# EAGLE design NEO-M8N+BMP280 Wing (EAGLE 9.0.1)
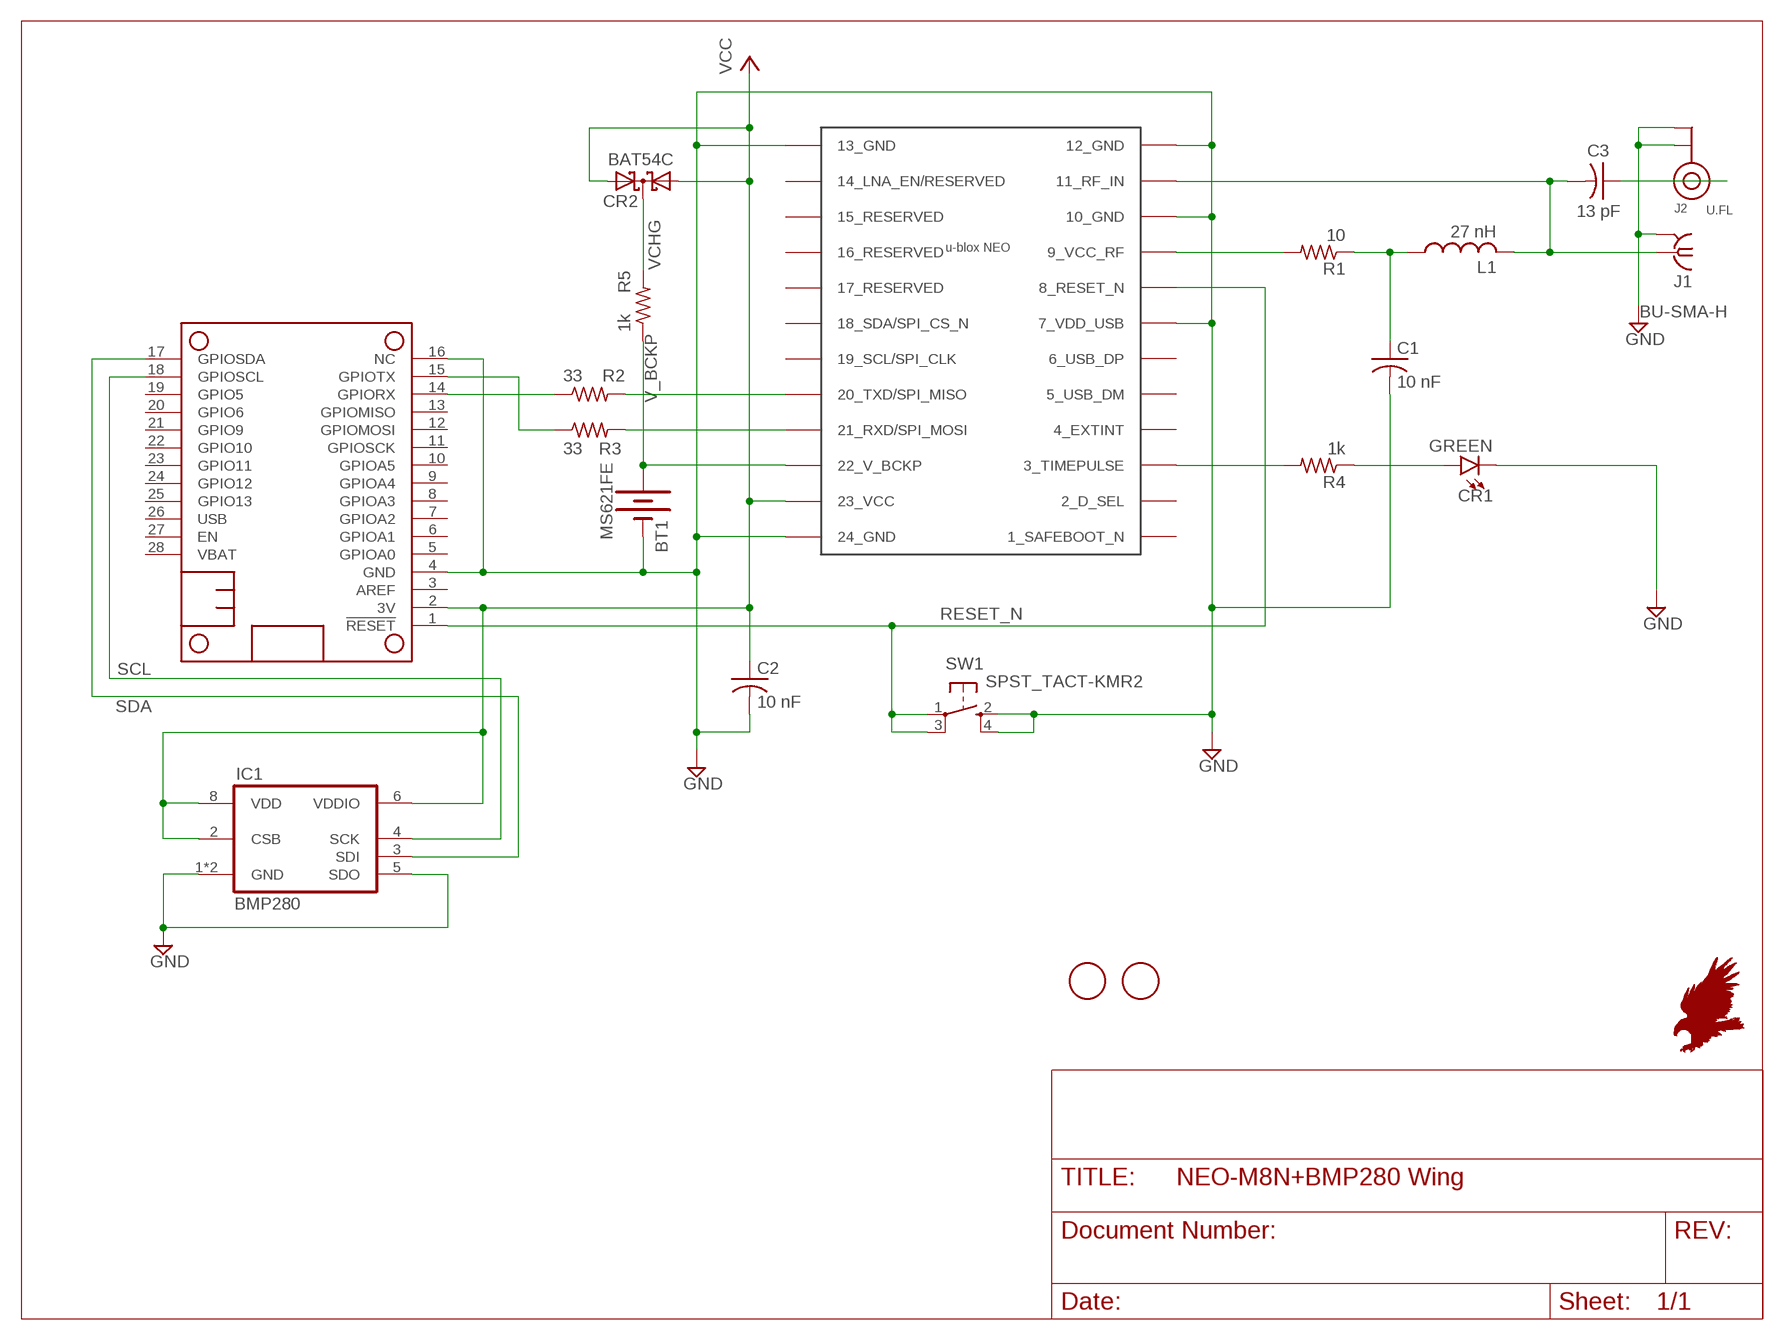
[diagram p0: schematic, sheet 1]

## Parts
BT1  MS621FE  BATTERY-6.8MM_SMD  [BATTCON-6.8MM]
C1  10 nF  C-USC0402  [C0402]
C2  10 nF  C-USC0402  [C0402]
C3  13 pF  C-USC0402  [C0402]
CR1  GREEN  LED-GREEN0603  [LED-0603]
CR2  BAT54C  [SOT23]
FID1  FIDUCIAL  [FIDUCIAL_1MM]
FID2  FIDUCIAL  [FIDUCIAL_1MM]
IC1  BMP280  [BMP280]
J1  BU-SMA-H  [BU-SMA-H]
J2  U.FL  ANTENNA_U.FL  [U.FL]
L1  27 nH  L-US0402  [L0402]
MS1  FEATHERWING  [FEATHERWING]
R1  10  R-US_R0805  [R0805]
R2  33  R-US_R0805  [R0805]
R3  33  R-US_R0805  [R0805]
R4  1k  R-US_R0805  [R0805]
R5  1k  R-US_R0805  [R0805]
SW1  SPST_TACT-KMR2  [KMR2]
U$2  NEO-M8  [NEO-M8]

## Nets
FEATHER_RXD: MS1.14(GPIORX) R2.1
FEATHER_TXD: MS1.15(GPIOTX) R3.1
GND [GND]: BT1.- C1.2 C2.2 CR1.C IC1.1(GND) IC1.5(SDO) IC1.7(GND) J1.2 J1.3 J1.4 J1.5 J2.1(GND) J2.2(GND) MS1.4(GND) MS1.16(NC) SW1.2(S) SW1.4(S1) U$2.7(7_VDD_USB) U$2.10(10_GND) U$2.12(12_GND) U$2.13(13_GND) U$2.24(24_GND)
GPS_RXD: R3.2 U$2.21(21_RXD/SPI_MOSI)
GPS_TXD: R2.2 U$2.20(20_TXD/SPI_MISO)
J2_RF: C3.1 J2.3(SIGNAL)
LED_ANODE: CR1.A R4.1
LNA_BIAS [VCC]: C1.1 L1.P$1 R1.1
RESET_N: MS1.1(!RESET) SW1.1(P) SW1.3(P1) U$2.8(8_RESET_N)
RF_IN [RF_IN]: C3.2 J1.1 L1.P$2 U$2.11(11_RF_IN)
SCL: IC1.4(SCK) MS1.18(GPIOSCL)
SDA: IC1.3(SDI) MS1.17(GPIOSDA)
TP: R4.2 U$2.3(3_TIMEPULSE)
V_BCKP: BT1.+ R5.1 U$2.22(22_V_BCKP)
VCC [VCC]: C2.1 CR2.1(A1) CR2.2(A2) IC1.2(CSB) IC1.6(VDDIO) IC1.8(VDD) MS1.2(3V) U$2.23(23_VCC)
VCC_RF [VCC]: R1.2 U$2.9(9_VCC_RF)
VCHG: CR2.3(CC) R5.2
Unconnected: MS1.3(AREF) MS1.5(GPIOA0) MS1.6(GPIOA1) MS1.7(GPIOA2) MS1.8(GPIOA3) MS1.9(GPIOA4) MS1.10(GPIOA5) MS1.11(GPIOSCK) MS1.12(GPIOMOSI) MS1.13(GPIOMISO) MS1.19(GPIO5) MS1.20(GPIO6) MS1.21(GPIO9) MS1.22(GPIO10) MS1.23(GPIO11) MS1.24(GPIO12) MS1.25(GPIO13) MS1.26(USB) MS1.27(EN) MS1.28(VBAT) U$2.1(1_SAFEBOOT_N) U$2.2(2_D_SEL) U$2.4(4_EXTINT) U$2.5(5_USB_DM) U$2.6(6_USB_DP) U$2.14(14_LNA_EN/RESERVED) U$2.15(15_RESERVED) U$2.16(16_RESERVED) U$2.17(17_RESERVED) U$2.18(18_SDA/SPI_CS_N) U$2.19(19_SCL/SPI_CLK)

## Library data of the parts
BT1 = SparkFun-Batteries:BATTERY: Battery - Single Cell A variety of battery chemistries, sizes, and footprints. Device List: 20MM_PTH - Coin Cell Battery Holder - 20mm (PTH) <https://www.sparkfun.com/products/783> 6.8MM_PTH - Coin Cell Battery Holder - 6.8MM(SMD) <https://www.digikey.com/product-detail/en/seiko-instruments/MS621FE-FL11E/728-1057-ND/1889208?WT.srch=1&gclid=CNOQ5a6LzdQCFZS2wAodXCkE0g> 12MM_SMD - Coin Cell Battery Holder - 12mm (SMD) <https://www.sparkfun.com/products/10592> 12MM_PTH - Coin Cell Battery Holder - 12mm (PTH) <https://www.sparkfun.com/products/7948> 20MM_SMD - 20mm Coin Cell Battery Holder (SMD) (2 legs) Used on the Big Time Watch Kit <https://www.sparkfun.com/products/11734> 20MM_SMD_4LEGS - Coin Cell Battery Holder - 20mm (SMD) <https://www.sparkfun.com/products/11892> 20MM_SMD_4LEGS_OVERPASTE - Coin Cell Battery Holder - 20mm (SMD) <https://www.sparkfun.com/products/11892> (Over-paste on the legs) 24.5MM_PTH - Coin Cell Battery Holder - 24.5mm (PTH) <https://www.sparkfun.com/products/8863> 9V - 9V Battery Holder - PC Mount Used on the SparkFun SparkPunk Sound Kit <https://www.sparkfun.com/products/11177> and SparkFun SparkPunk Sequencer Kit <https://www.sparkfun.com/products/12707> 18650 - Battery Holder - 18650 (PTH) <https://www.sparkfun.com/products/13113> AA - Battery Holder - 1xAA (PTH) <https://www.sparkfun.com/products/7949> AAA - Battery Holder - 1xAAA (PTH) <https://www.sparkfun.com/products/12718> AA_KIT - Battery Holder - 1xAA (PTH) <https://www.sparkfun.com/products/7949> Special kit package - pads only have exposed copper on one side of the board. AAA_KIT - Battery Holder - 1xAAA (PTH) <https://www.sparkfun.com/products/12718> Special kit package - pads only have exposed copper on one side of the board.; PROD_ID: BATT-13734; VALUE: 6.8MM_COIN_CELL
C1-C3 = adafruit:C-US: CAPACITOR, American symbol
CR1 = SparkFun-LED:LED-GREEN: Green SMD LED Used in manufacturing of various products at SparkFun Packages: 0603 - SMD 0603 package [Product Link] <http://www.futureelectronics.com/en/technologies/semiconductors/optoelectronics/leds/Pages/9894312-LTST-C190GKT.aspx?CrossPart=HSMG-C190&IM=0> LilyPad 1206 - SMD1206 LilyPad package [Product Link] <http://www.futureelectronics.com/en/Technologies/Product.aspx?ProductID=IN150NGHARVATEKCORPORATION2049943&IM=0> 1206 - SMD1206 package [Product Link] <http://www.futureelectronics.com/en/technologies/semiconductors/optoelectronics/leds/Pages/8315665-LTST-C150KGKT.aspx?IM=0> 1206 Bottom Mount -SMD 1206 Bottom Mount [Product Link] <http://www.digikey.com/product-detail/en/lite-on-inc/LTST-C230KGKT/160-1456-1-ND/386854> SparkFun Products: Pro Mini 328 -5V <https://www.sparkfun.com/products/821> RedBoard <https://www.sparkfun.com/products/12757> MP3 Trigger <https://www.sparkfun.com/products/13720> Makey Makey <https://www.sparkfun.com/products/11076>; PROD_ID: DIO-00821
CR2 = diode:BAT54C: Schottky Diodes Source: Fairchild .. BAT54.pdf
FID1 FID2 = adafruit:FIDUCIAL: For use by pick and place machines to calibrate the vision/machine, 1mm By microbuilder.eu
IC1 = bosch-bmp280:BMP280: The BMP280 is an absolute barometric pressure sensor especially designed for mobile applications. The sensor module is housed in an extremely compact 8-pin metal-lid LGA package with a footprint of only 2.0 × 2.5 mm2 and 0.95 mm package height. Its small dimensions and its low power consumption of 2.7 μA @1Hz allow the implementation in battery driven devices such as mobile phones, GPS modules or watches. The library has been designed by Richard Magdycz <https://www.facebook.com/groups/eaglecadsoftUK>
J1 = con-coax:BU-SMA-H: FEMALE SMA CONNECTOR Radiall; OC_FARNELL: unknown; OC_NEWARK: unknown
J2 = adafruit:ANTENNA_U.FL: U.FL Antenna Connector
L1 = murata-inductors:L-US
MS1 = adafruit:FEATHERWING
R1-R5 = adafruit:R-US_: RESISTOR, American symbol
SW1 = adafruit:SPST_TACT: SMT 6mm switch, EVQQ2 series http://www.ladyada.net/library/eagle
U$2 = ubloxLib:NEO-M8: u-blox NEO GNSS module

## Net classes
0 default: width 0.254 mm
1 GND: width 0.635 mm
2 VCC: width 0.381 mm
3 RF_IN: width 0.508 mm

## Board
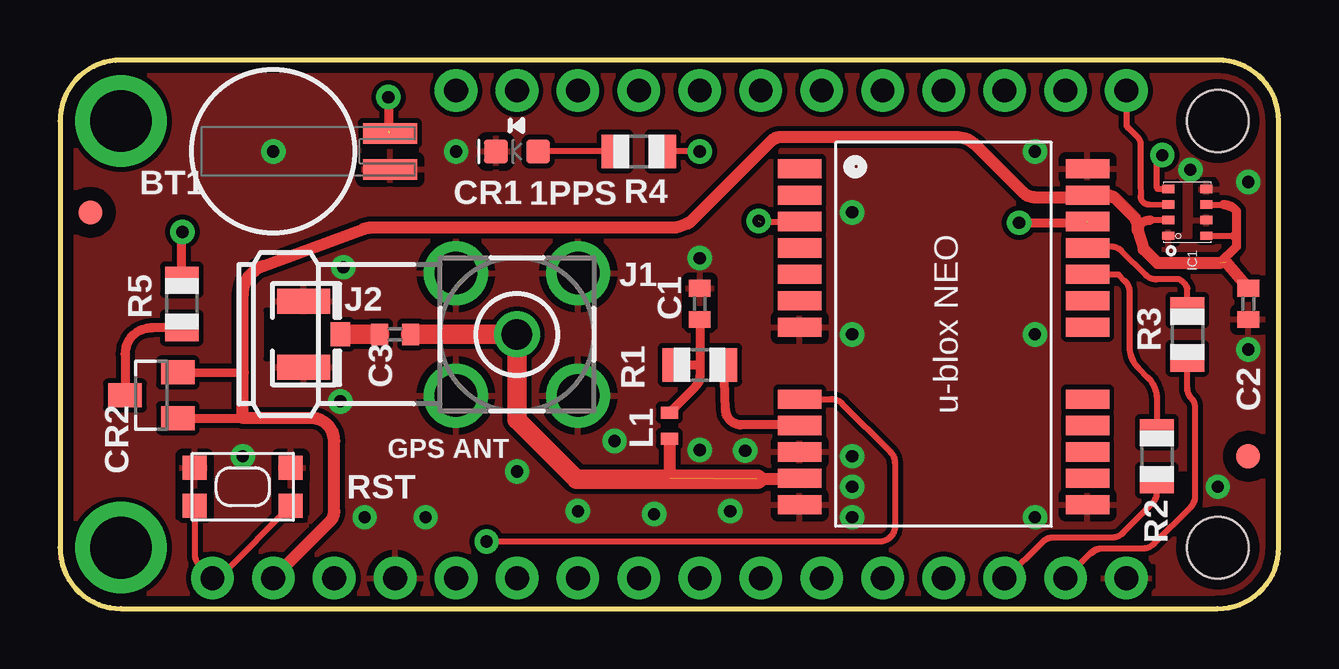
[diagram p1: board, top side]
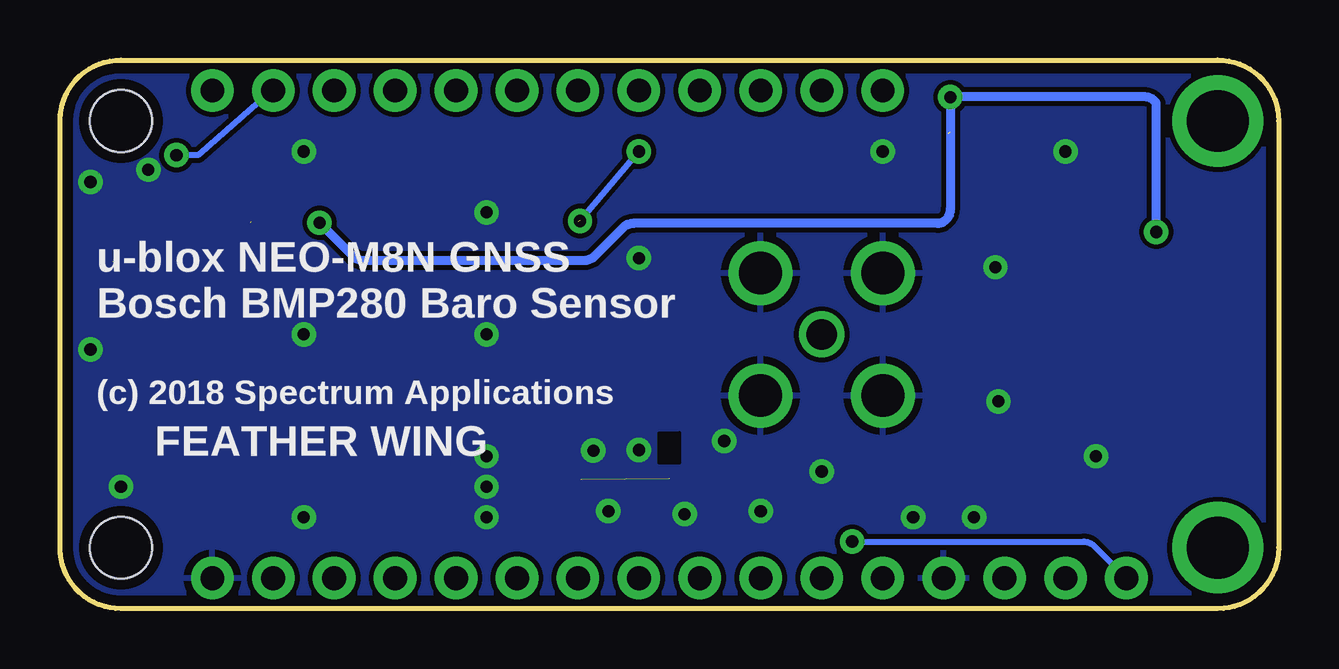
[diagram p2: board, bottom side, seen from below]

Size 50.8 x 22.86 mm. Coordinates in mm from the lower left corner, seen from the top.
Outline: 48.26,22.86 2.54,22.86 arc90 0,20.32 0,2.54 arc90 2.54,0 48.26,0 arc90 50.8,2.54 50.8,20.32 arc90 48.26,22.86
Copper layers (1*16): Top 0.035mm / dielectric 1.5mm / Bottom 0.035mm
Design rules "SparkFun *": minimum track width 8mil, minimum drill 20mil, track to track 8mil, track to pad 8mil, pad to pad 8mil, via to via 8mil, smd to smd 8mil, copper to edge 17.5mil, drill to drill 8mil, minimum pad ring 12mil, minimum via ring 10mil, stop-mask expansion 4mil, vias tented up to drill 30mil, thermal gap 12mil
tRestrict: area 46.7,5.1 to 47,5.6; area 47.4,17.3 to 47.4,17.7; area 47.4,17.3 to 47.4,17.7; 31 lines
bRestrict: 12 lines

### Footprints (pad centres in the part's own frame; a part is rotated, then mirrored left to right if it is on the bottom)
BATTCON-6.8MM = smd 2.25 x 0.85: + 4.87,0.75; - 4.87,-0.75
C0402 = smd 0.7 x 0.9: 1 -0.65,0; 2 0.65,0
LED-0603 = smd 1 x 1: A -0.877,0; C 0.877,0
SOT23 = smd 1 x 1.4: 1 -0.95,-1.1; 2 0.95,-1.1; 3 0,1.1
FIDUCIAL_1MM = smd 1 x 1: 1 0,0
BMP280 = smd 0.35 x 0.5: 1 0.975,-0.8; 2 0.325,-0.8; 3 -0.325,-0.8; 4 -0.975,-0.8; 5 -0.975,0.8; 6 -0.325,0.8; 7 0.325,0.8; 8 0.975,0.8
BU-SMA-H = drill 1.27: 1 0,0 | drill 1.778: 2 -2.55,2.55; 3 2.55,2.55; 4 2.55,-2.55; 5 -2.55,-2.55
U.FL = smd 2.2 x 1.05: 1 0,1.375; 2 0,-1.375 | smd 0.8 x 1: 3 1.525,0
L0402 = smd 0.5 x 0.7: P$1 -0.55,0; P$2 0.55,0
FEATHERWING = drill 0.991 pad 1.778: 1 6.35,1.27; 2 8.89,1.27; 3 11.43,1.27; 4 13.97,1.27; 5 16.51,1.27; 6 19.05,1.27; 7 21.59,1.27; 8 24.13,1.27; 9 26.67,1.27; 10 29.21,1.27; 11 31.75,1.27; 12 34.29,1.27; 13 36.83,1.27; 14 39.37,1.27; 15 41.91,1.27; 16 44.45,1.27; 17 44.45,21.59; 18 41.91,21.59; 19 39.37,21.59; 20 36.83,21.59; 21 34.29,21.59; 22 31.75,21.59; 23 29.21,21.59; 24 26.67,21.59; 25 24.13,21.59; 26 21.59,21.59; 27 19.05,21.59; 28 16.51,21.59 | drill 2.578 pad 3.81: P$1 2.54,20.32; P$2 2.54,2.54 | hole 2.578: 48.26,20.32; 48.26,2.54
R0805 = smd 1.1 x 1.4: 1 -1,0; 2 1,0
KMR2 = smd 1 x 1: 1 2,0.8; 2 2,-0.8; 3 -2,0.8; 4 -2,-0.8
NEO-M8 = smd 1.8 x 0.8: 1 6,-6.9; 2 6,-5.8; 3 6,-4.7; 4 6,-3.6; 5 6,-2.5; 6 6,-1.4; 7 6,-0.3; 8 6,2.7; 9 6,3.8; 10 6,4.9; 11 6,6; 12 6,7.1; 13 -6,7.1; 14 -6,6; 15 -6,4.9; 16 -6,3.8; 17 -6,2.7; 18 -6,-0.3; 19 -6,-1.4; 20 -6,-2.5; 21 -6,-3.6; 22 -6,-4.7; 23 -6,-5.8; 24 -6,-6.9

### Placement (x,y rotation side)
BT1  8.89,19.05 0 top
C1  26.67,12.7 90 top
C2  49.53,12.7 270 top
C3  13.97,11.43 0 top
CR1  19.05,19.05 180 top
CR2  3.81,8.89 90 top
FID1  1.27,16.51 0 top
FID2  49.53,6.35 0 top
IC1  46.99,16.51 270 top
J1  19.05,11.43 180 top
J2  10.16,11.43 0 top
L1  25.4,7.62 270 top
MS1  0,0 0 top
R1  26.67,10.16 0 top
R2  45.72,6.35 90 top
R3  46.99,11.43 90 top
R4  24.13,19.05 0 top
R5  5.08,12.7 270 top
SW1  7.62,5.08 180 top
U$2  36.83,11.43 180 top

### Tracks (layer width: path | path; a pad name or v marks a point on that pad's centre or on a via)
FEATHER_RXD
  Top 0.254: R2.1 45.72,4.83 arc-45 45.53,4.39 44.31,3.16 arc-45 43.86,2.97 41.95,2.97 41.91,2.97 41.41,2.97 arc45 40.96,2.79 39.43,1.26 MS1.14
FEATHER_TXD
  Top 0.254: 43.02,2.33 arc-45 43.47,2.52 | R3.1 46.98,10.4 46.98,9.21 arc45 47.16,8.76 arc-45 47.32,8.38 47.32,4.68 arc-45 47.13,4.23 45.6,2.7 arc-45 45.15,2.52 43.47,2.52 | MS1.15 42.97,2.33 arc-45 43.42,2.52 43.47,2.52
GND  (via drill 0.51)
  other vias: 16.51,19.05 33.02,16.51 15.24,3.81 47.12,18.29 49.53,10.79 48.26,5.08 8.89,19.05 11.68,8.64 12.7,3.81 40.64,19.05 33.02,11.43 33.02,5.08 40.64,3.81 7.62,6.35 40.64,11.43 33.02,6.35 33.02,3.81 27.94,4.06 28.57,6.58 11.81,14.22 49.53,17.78 26.67,14.61 26.67,6.61 21.59,4.06 19.05,5.71 24.77,3.94 23.11,6.99
  pour Top: 48.26,22.86 2.54,22.86 arc90 0,20.32 0,2.54 arc90 2.54,0 48.26,0 arc90 50.8,2.54 50.8,20.32 arc90
  pour Bottom: 48.26,22.86 2.54,22.86 arc90 0,20.32 0,2.54 arc90 2.54,0 48.26,0 arc90 50.8,2.54 50.8,20.32 arc90
GPS_RXD
  Top 0.254: U$2.21 42.86,15.09 43.81,15.09 arc-45 44.26,14.9 45.26,13.9 arc45 45.7,13.72 46.66,13.72 arc-45 46.99,13.35 R3.2
GPS_TXD
  Top 0.254: R2.2 45.72,8.73 arc45 45.35,9.63 44.95,10.03 arc-45 44.58,10.93 44.58,13.2 arc45 44.39,13.65 44.12,13.92 arc45 44.1,13.93 U$2.20 42.86,13.83
J2_RF
  Top 0.813: C3.1 J2.3
LED_ANODE
  Top 0.254: R4.1 CR1.A
LNA_BIAS
  Top 0.381: 26.67,10.16 26.67,9.7 arc-45 26.48,9.25 L1.P$1 | R1.1 26.67,10.16 | C1.1 26.67,10.16 arc-45 26.67,10.16
RESET_N  (via drill 0.51)
  Top 0.254: 31.22,8.89 arc45 U$2.8 32.16,8.73 arc-45 32.6,8.54 34.61,6.54 arc-45 34.8,6.09 34.8,3.43 arc-90 34.16,2.79 v17.78,2.79 | SW1.3 6.79,1.45 arc-45 MS1.1 5.81,1.81 arc-45 5.62,2.26 SW1.1
  Bottom 0.254: v17.78,2.79 8.14,2.79 arc45 7.69,2.61 MS1.1
RF_IN  (1 unrouted)
  Top 0.508: L1.P$2 25.4,5.43 | U$2.11 30.79,5.39 29.08,5.39
  Top 0.813: C3.2 J1.1 19.05,7.87 21.54,5.39 29.08,5.39
SCL  (via drill 0.51)
  Top 0.254: 46.18,17.49 IC1.4 45.76,17.48 45.72,17.53 45.72,18.67 v45.95,18.9
  Bottom 0.254: v45.95,18.9 45.03,18.9 41.95,21.6 MS1.18
SDA
  Top 0.254: MS1.17 44.45,20.21 arc45 44.52,20.03 44.96,19.59 arc-45 45.03,19.41 45.03,17.72 45.04,17.18 arc89 45.39,16.84 IC1.3
TP  (via drill 0.51)  (1 unrouted)
  Top 0.254: U$2.3 30.75,16.12 29.21,16.12 | v26.67,19.05 R4.2
  Bottom 0.254: v29.12,16.15 v26.67,19.05
V_BCKP  (via drill 0.51)  (2 unrouted)
  Top 0.381: v13.69,21.31 13.69,19.86 arc-90 13.72,19.89 | v39.98,16.08 42.85,16.08 arc90 42.88,16.1 | R5.1 5.08,15.67 v5.11,15.7
  Bottom 0.381: v5.11,15.7 5.11,20.99 arc-45 5.17,21.15 arc-45 5.62,21.34 13.66,21.34 v13.69,21.31 13.69,16.65 arc45 13.88,16.2 arc45 14.22,16.05 26.89,16.05 arc-45 27.34,15.87 28.52,14.69 arc45 28.96,14.5 38.14,14.5 arc45 38.59,14.69 v39.98,16.08
VCC  (1 unrouted)
  Top 0.254: IC1.6 48.51,16.84 | IC1.2 45.46,16.18 | IC1.8 48.94,15.54
  Top 0.381: 49.03,15.49 49.03,16.57 48.96,16.65 arc45 48.51,16.84 | 49.03,15.49 49.03,15.09 48.35,14.4 | 42.86,17.14 U$2.23 | 45.46,16.18 arc45 45.02,16 44.92,15.9 | 48.94,15.54 arc-45 49.03,15.49 | CR2.2 7.62,9.83 | CR2.1 7.62,7.94
  Top 0.508: 48.6,14.45 C2.1 | 48.35,14.4 45.74,14.4 45.17,14.97 44.92,15.77 44.92,15.9 arc45 44.73,16.35 44.04,17.04 arc45 43.59,17.23 U$2.23 | MS1.2 11.24,3.62 arc45 11.43,4.07 11.43,6.99 arc90 10.47,7.94 7.62,7.94 7.62,9.83 7.62,13.08 arc-70 8.45,14.28 12.64,15.81 arc-20 13.08,15.89 25.73,15.9 26.1,16.03 arc26 26.34,16.18 29.63,19.47 arc-45 30.08,19.66 37.31,19.66 arc-45 38.2,19.29 40.16,17.33 arc45 40.61,17.14 42.86,17.14
VCC_RF
  Top 0.381: R1.2 27.75,8.27 arc88 28.38,7.66 30.75,7.66 U$2.9
VCHG
  Top 0.381: 5.04,11.66 arc90 R5.2 3.83,11.7 3.77,11.7 3.62,11.68 3.44,11.63 3.33,11.58 3.19,11.51 3.05,11.4 2.98,11.34 2.85,11.13 2.76,10.92 2.72,10.74 2.71,10.61 CR2.3

### Text on the board
bPlace: u-blox NEO-M8N GNSS / Bosch BMP280 Baro Sensor | (c) 2018 Spectrum Applications | FEATHER WING
tNames: 1PPS | GPS ANT | RST